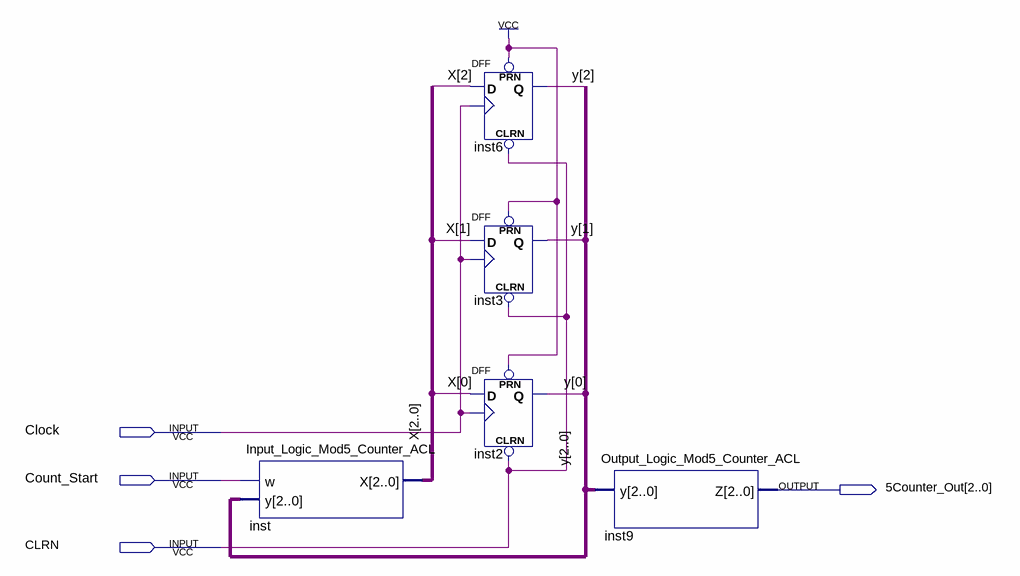
[diagram p0: schematic sheet]
// Quartus schematic Mod5_Counter_ACL.bdf as structural Verilog: 5 symbols, 4 pins
module Mod5_Counter_ACL (
  input  Clock,
  input  Count_Start,
  input  CLRN,
  output [2:0] \5Counter_Out 
);

  wire [2:0] X, y;

  Input_Logic_Mod5_Counter_ACL inst (.w(Count_Start), .y(y), .X(X));
  DFF inst6 (.CLRN(CLRN), .CLK(Clock), .D(X[2]), .PRN(1'b1), .Q(y[2]));
  DFF inst3 (.CLRN(CLRN), .CLK(Clock), .D(X[1]), .PRN(1'b1), .Q(y[1]));
  DFF inst2 (.CLRN(CLRN), .CLK(Clock), .D(X[0]), .PRN(1'b1), .Q(y[0]));
  Output_Logic_Mod5_Counter_ACL inst9 (.y(y), .Z(\5Counter_Out ));
endmodule
